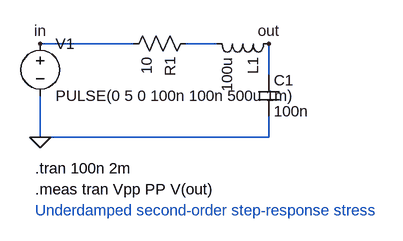
[diagram p0: schematic 08_tran_rlc_ringing.asc]
08_tran_rlc_ringing.asc, the LTspice schematic file:
Version 4
SHEET 1 880 680
WIRE 80 96 224 96
WIRE 304 96 352 96
WIRE 432 96 432 144
WIRE 432 208 432 240
WIRE 80 176 80 240
WIRE 80 240 432 240
FLAG 80 240 0
FLAG 80 96 in
FLAG 432 96 out
SYMBOL voltage 80 80 R0
SYMATTR InstName V1
SYMATTR Value PULSE(0 5 0 100n 100n 500u 1m)
SYMBOL res 320 80 R90
SYMATTR InstName R1
SYMATTR Value 10
SYMBOL ind 448 80 R90
SYMATTR InstName L1
SYMATTR Value 100u
SYMBOL cap 416 144 R0
SYMATTR InstName C1
SYMATTR Value 100n
TEXT 72 288 Left 2 !.tran 100n 2m
TEXT 72 320 Left 2 !.meas tran Vpp PP V(out)
TEXT 72 352 Left 2 ;Underdamped second-order step-response stress

The netlist it stands for:
* 08_tran_rlc_ringing.asc
V1 in 0 PULSE(0 5 0 100n 100n 500u 1m)
R1 N001 in 10
L1 out N001 100u
C1 out 0 100n
.tran 100n 2m
.meas tran Vpp PP V(out)
* Underdamped second-order step-response stress
.backanno
.end